# EAGLE design rubidium-osc-sa22c-breakout (EAGLE 9.2.2)
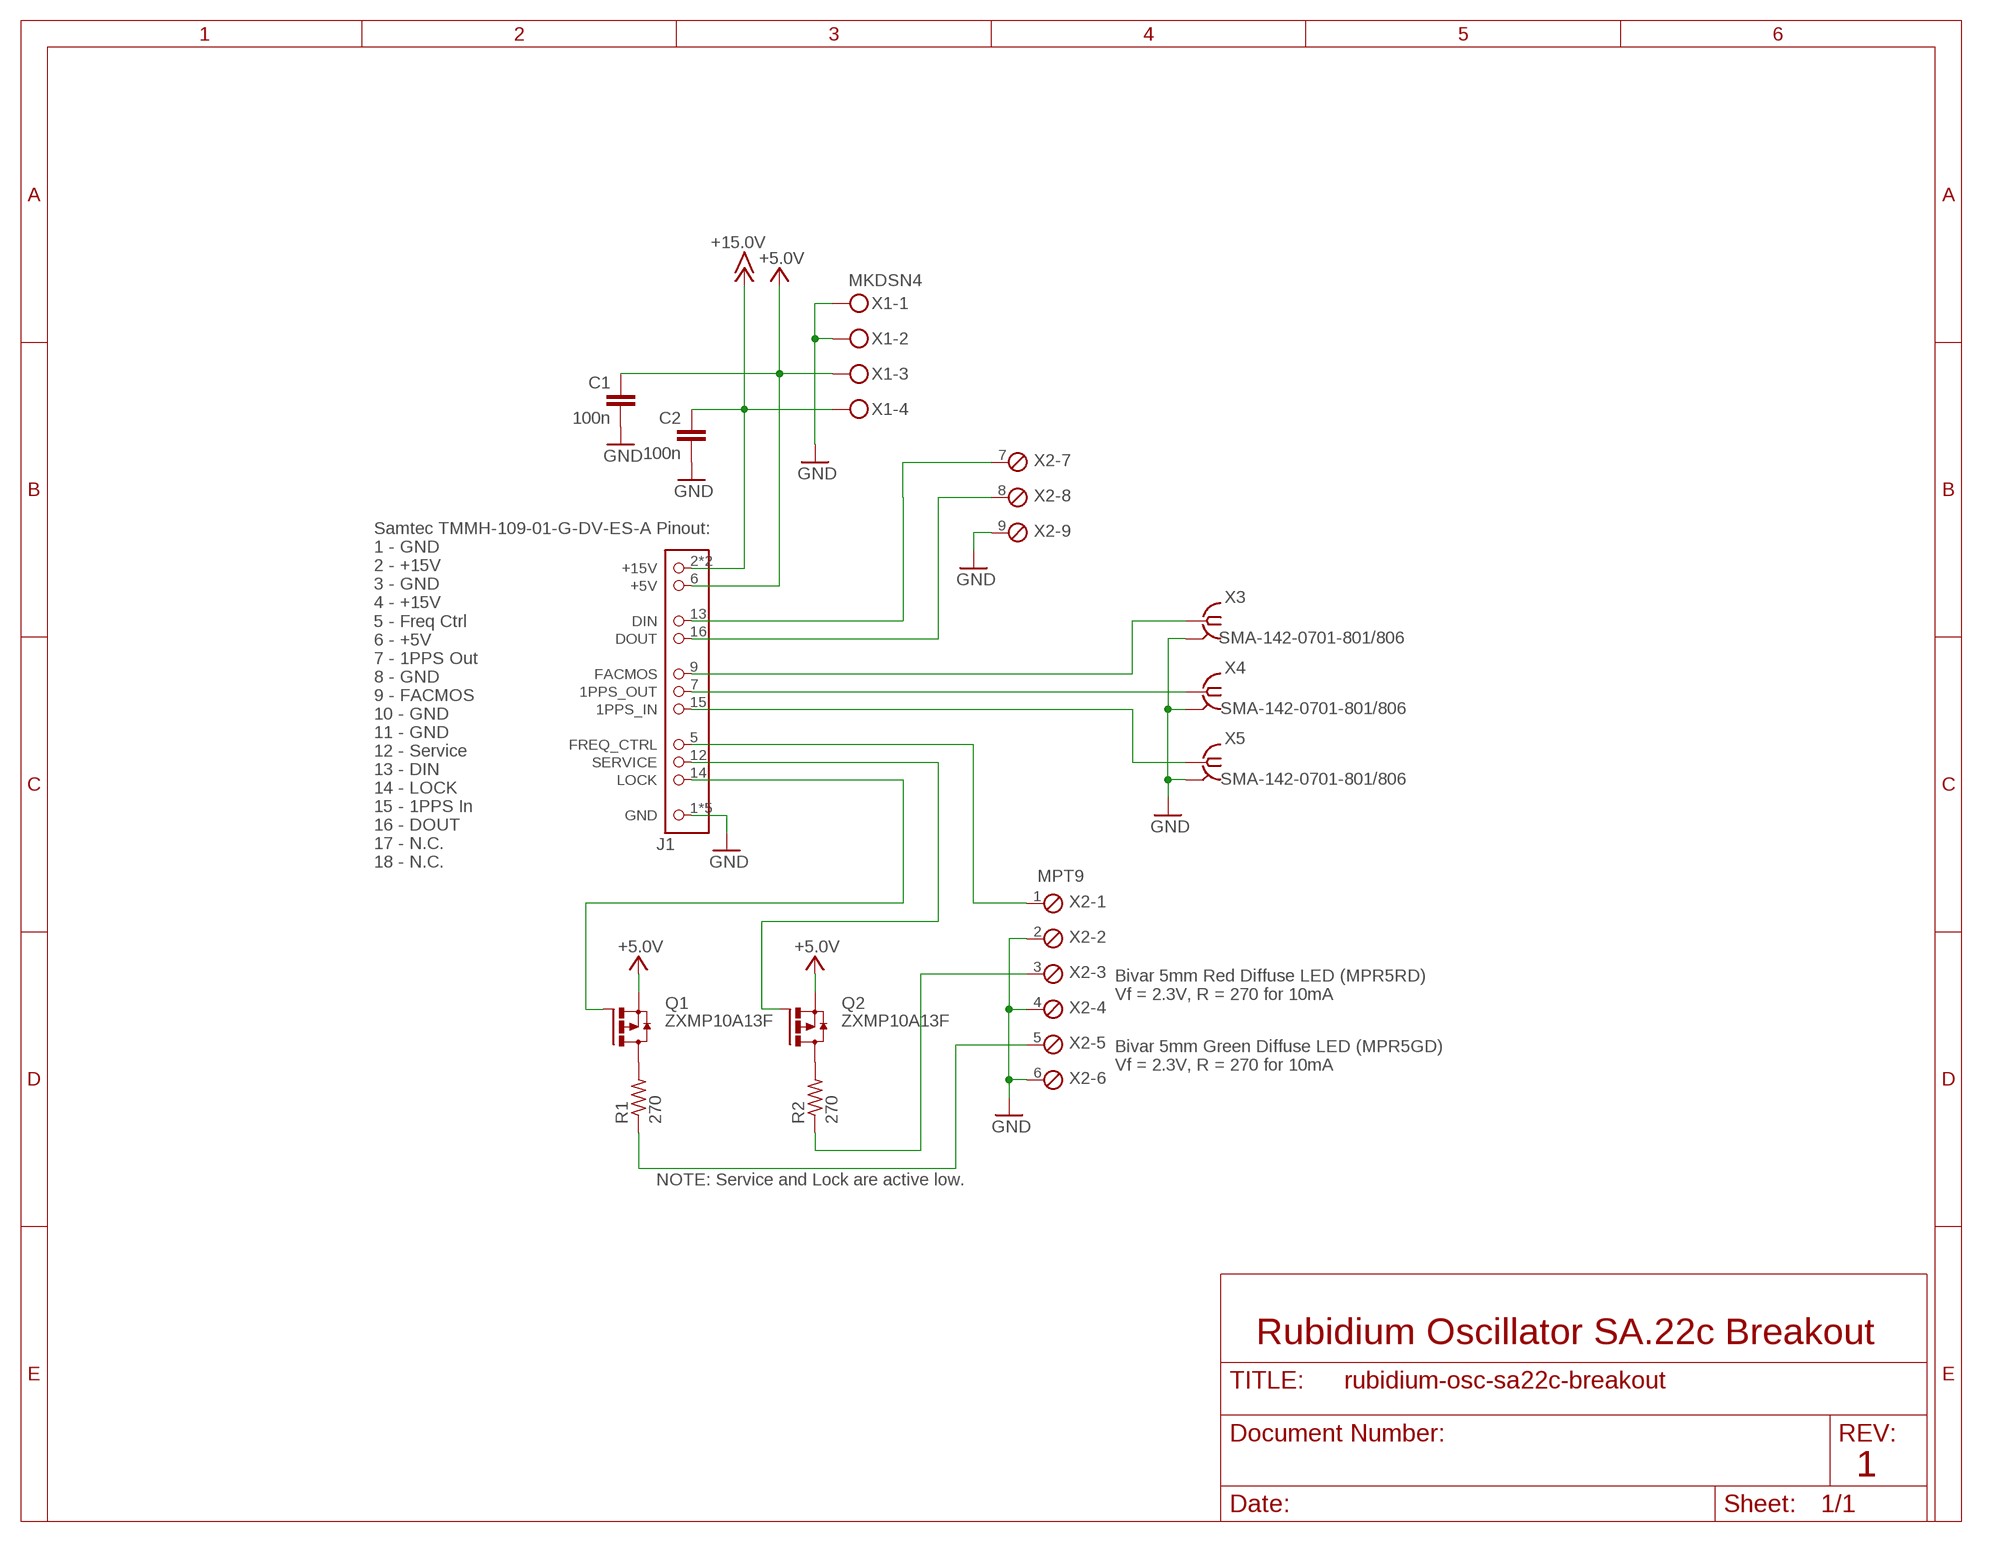
[diagram p0: schematic, sheet 1]

## Parts
C1  100n  C-EUC0603  [C0603]
C2  100n  C-EUC0603  [C0603]
J1  OSC_TMMH-109-01-G-DV-ES-A  [TMMH-109-XX-XX-DV-ES-A]
Q1  ZXMP10A13F  FDN360P  [SUPER-SOT3]
Q2  ZXMP10A13F  FDN360P  [SUPER-SOT3]
R1  270  R-US_R0603  [R0603]
R2  270  R-US_R0603  [R0603]
X1  MKDSN4  MKDSN1,5/4-5,08  [MKDSN1,5/4-5,08]
X2  MPT9  [9POL254]
X3  SMA-142-0701-801/806  [J502-ND-142-0701-801/806]
X4  SMA-142-0701-801/806  [J502-ND-142-0701-801/806]
X5  SMA-142-0701-801/806  [J502-ND-142-0701-801/806]

## Nets
+5V: C1.1 J1.6(+5V) Q1.2(S) Q2.2(S) X1.3 ; supply symbol labelled +5.0V
+15V: C2.1 J1.2(+15V) J1.4(+15V) X1.4 ; supply symbol labelled +15.0V
GND: C1.2 C2.2 J1.1(GND) J1.3(GND) J1.8(GND) J1.10(GND) J1.11(GND) X1.1 X1.2 X2.2 X2.4 X2.6 X2.9 X3.G@1 X3.G@2 X3.G@3 X3.G@4 X4.G@1 X4.G@2 X4.G@3 X4.G@4 X5.G@1 X5.G@2 X5.G@3 X5.G@4
N$1 [RF1]: J1.9(FACMOS) X3.1
N$2: J1.7(1PPS_OUT) X4.1
N$3: J1.15(1PPS_IN) X5.1
N$4: J1.13(DIN) X2.7
N$5: J1.16(DOUT) X2.8
N$6: Q1.3(D) R1.2
N$7: J1.5(FREQ_CTRL) X2.1
N$8: J1.12(SERVICE) Q2.1(G)
N$9: J1.14(LOCK) Q1.1(G)
N$10: Q2.3(D) R2.2
N$12: R2.1 X2.3
N$13: R1.1 X2.5

## Notes on the sheet
- Bivar 5mm Red Diffuse LED (MPR5RD)
  Vf = 2.3V, R = 270 for 10mA
- Bivar 5mm Green Diffuse LED (MPR5GD)
  Vf = 2.3V, R = 270 for 10mA
- NOTE: Service and Lock are active low.
- Rubidium Oscillator SA.22c Breakout
- 1

## Library data of the parts
C1 C2 = rcl:C-EU: CAPACITOR, European symbol; SPICEPREFIX: C
J1 = J-Samtec-TMMH-1XX-XX-XX-DV-XXX-XXX:OSC_TMMH-109-01-G-DV-ES-A: Samtec connector for SA.22c rubidium oscillator
Q1 Q2 = transistor-power:FDN360P: Single P-Channel, PowerTrench (R) MOSFET Source: http://www.fairchildsemi.com/ds/FD/FDN360P.pdf
R1 R2 = rcl:R-US_: RESISTOR, American symbol; SPICEPREFIX: R
X1 = con-phoenix-508:MKDSN1,5/4-5,08: MKDSN 1,5/ 4-5,08 Printklemme Nennstrom: 13,5 A Nennspannung: 250 V Rastermaß: 5,08 mm Polzahl: 4 Anschlussart: Schraubanschluss Montage: Löten Anschlussrichtung Leiter/Platine: 0 ° Artikelnummer: 1729144 Source: http://eshop.phoenixcontact.com .. 1729144.pdf
X2 = con-phoenix-254:MPT9: PHOENIX CONNECTOR; OC_FARNELL: unknown; OC_NEWARK: unknown
X3-X5 = con-coax:SMA-: SMA 50 Ohm End Launch Jack Receptacle - Round Contact Johnson Components Source: www.johnsoncomponents.com .. J502-ND.pdf; MF: JOHNSON COMPONENTS; MPN: 142-0701-801; OC_FARNELL: 1608592; OC_NEWARK: 90F2624

## Net classes
1 RF1: clearance 0.203 mm

## Board
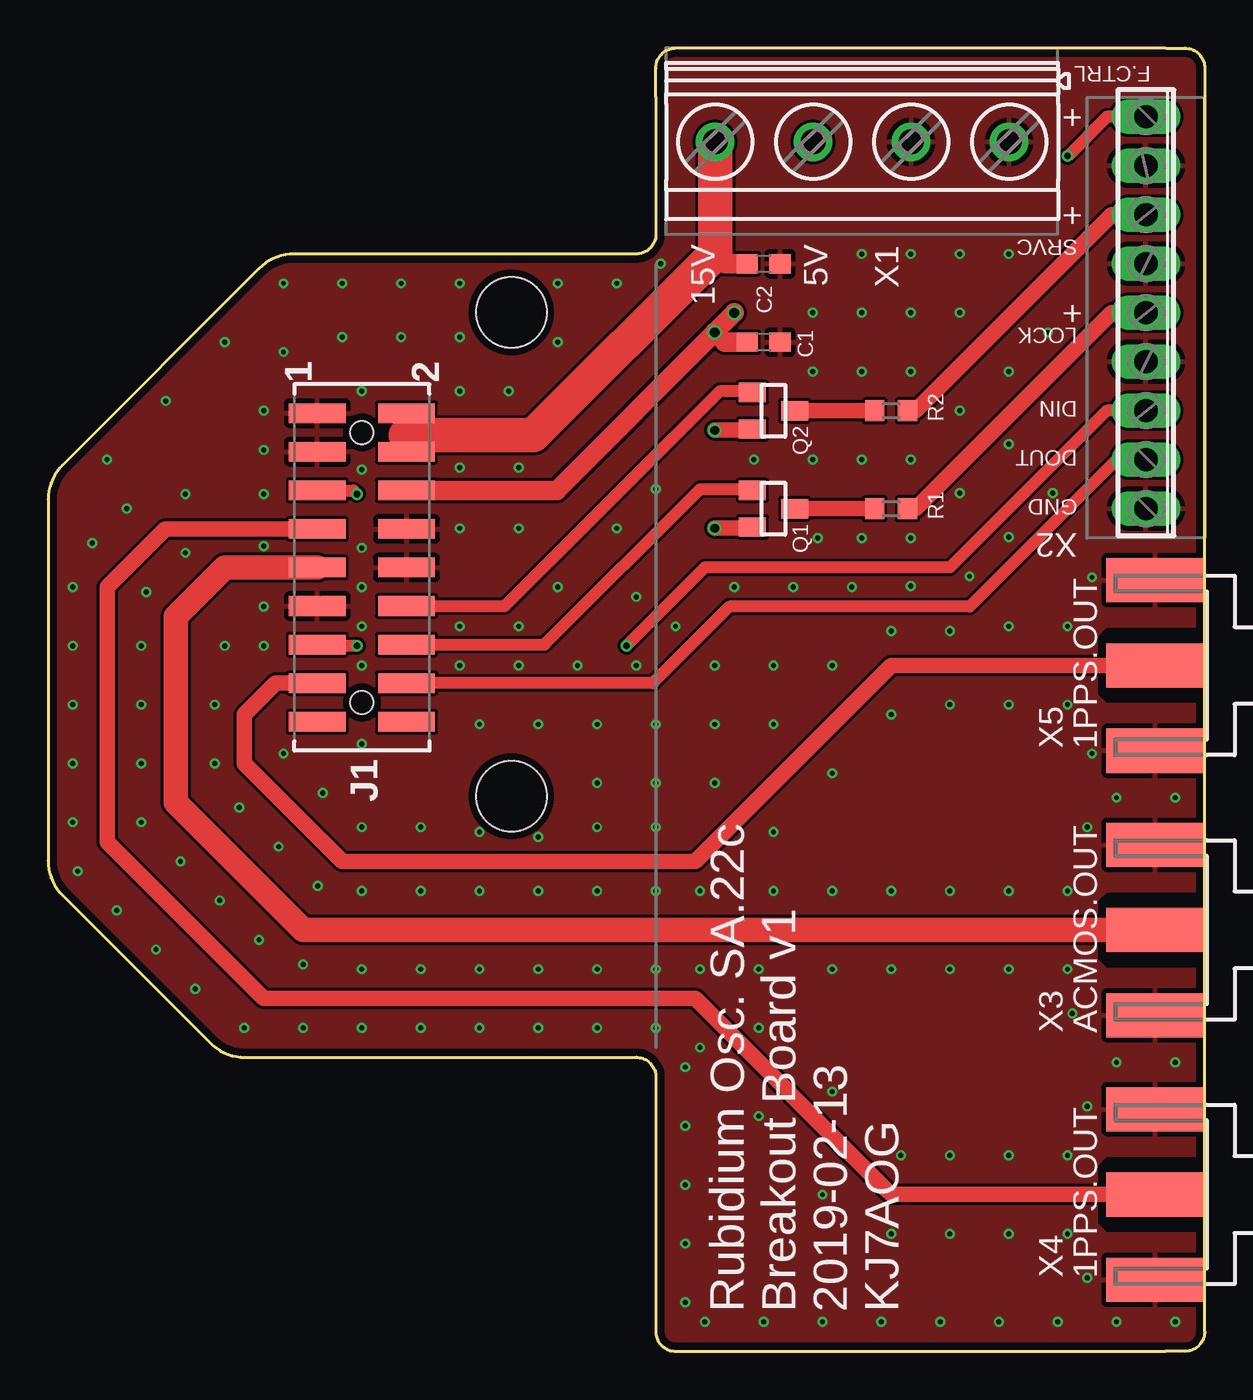
[diagram p1: board, top side]
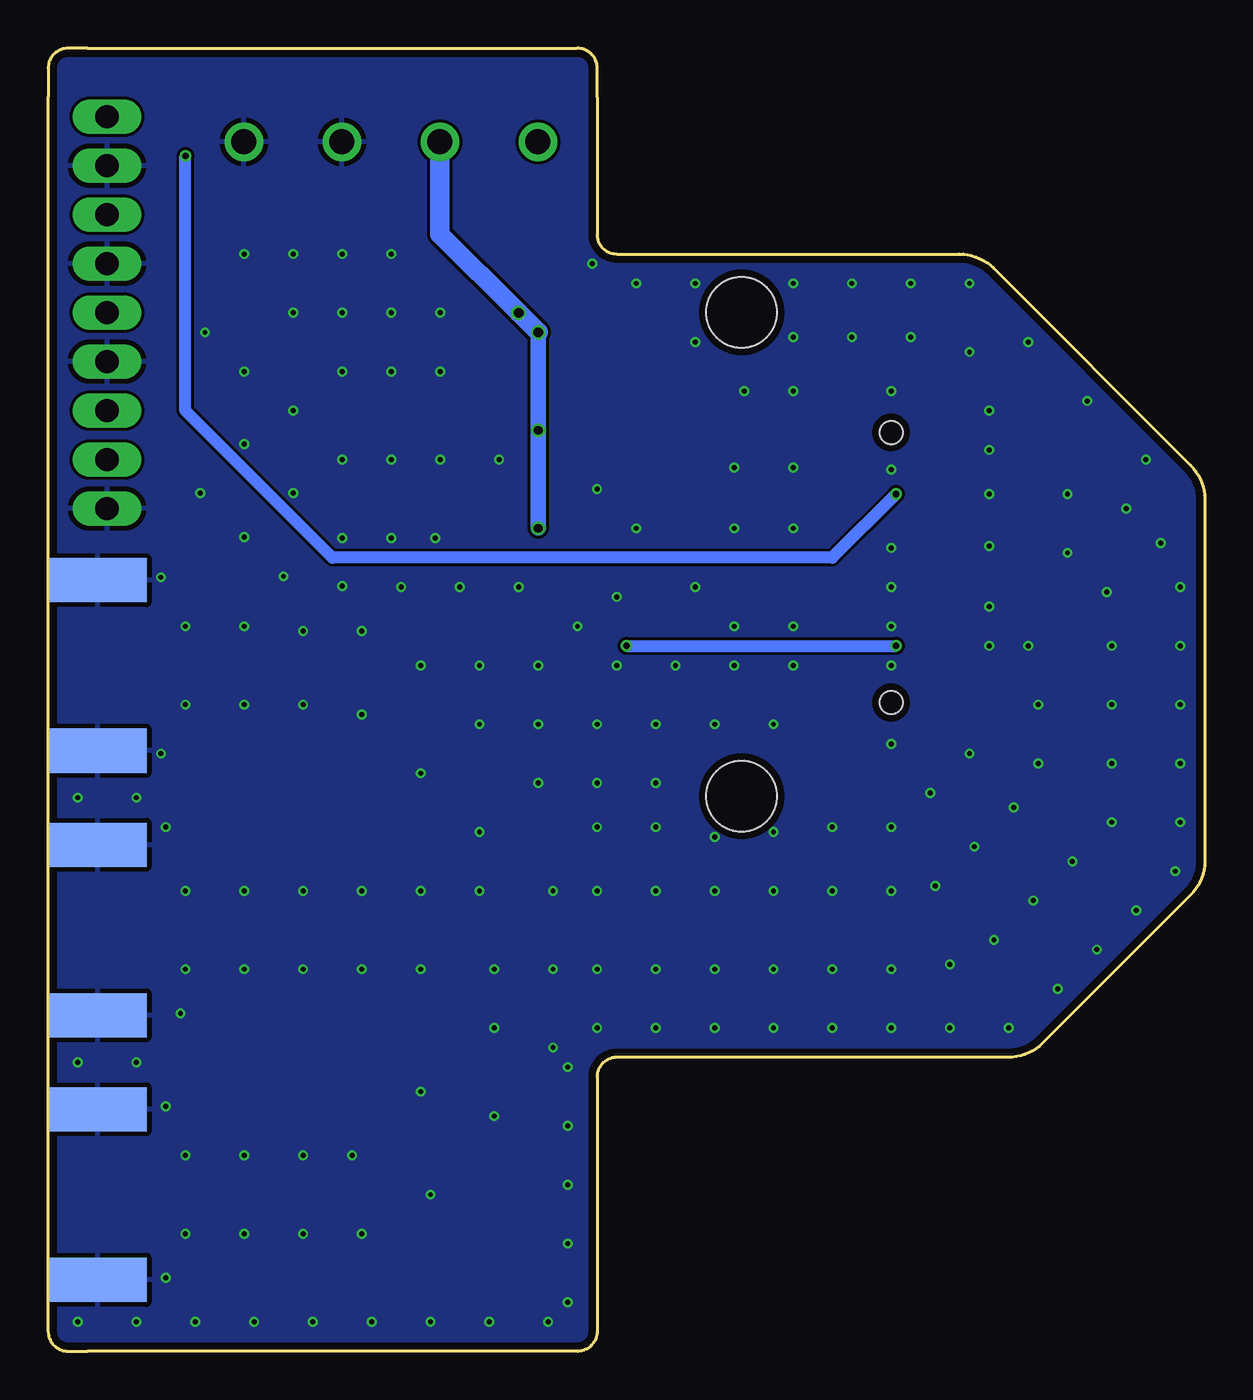
[diagram p2: board, bottom side, seen from below]

Size 59.94 x 67.56 mm. Coordinates in mm from the lower left corner, seen from the top.
Outline: 57.91,67.56 32.51,67.56 arc90 31.5,66.55 31.5,65.02 31.5,57.91 arc-90 30.48,56.9 12.74,56.9 arc45 10.94,56.15 0.74,45.96 arc45 0,44.16 0,25.44 arc45 0.74,23.64 8.4,15.98 arc45 10.2,15.24 30.48,15.24 arc-90 31.5,14.22 31.5,1.02 arc90 32.51,0 57.91,0 58.93,0 arc90 59.94,1.02 59.94,65.02 59.94,66.55 arc90 58.93,67.56 57.91,67.56
Copper layers (1*16): Top 0.035559375mm / dielectric 1.6mm / Bottom 0.035559375mm
Design rules "oshpark-2layer-tented": minimum track width 6mil, minimum drill 10mil, track to track 6mil, track to pad 6mil, pad to pad 6mil, via to via 6mil, smd to smd 6mil, copper to edge 15mil, drill to drill 6mil, minimum pad ring 5mil, minimum via ring 5mil, stop-mask expansion 2.5mil, vias tented up to drill 20mil, thermal gap 10mil
Holes 3.66 mm at 24,28.78 24,53.87

### Footprints (pad centres in the part's own frame; a part is rotated, then mirrored left to right if it is on the bottom)
C0603 = smd 1.1 x 1: 1 -0.85,0; 2 0.85,0
TMMH-109-XX-XX-DV-ES-A = smd 1.016 x 2.94: 1 -8,-2.315; 2 -8,2.315; 3 -6,-2.315; 4 -6,2.315; 5 -4,-2.315; 6 -4,2.315; 7 -2,-2.315; 8 -2,2.315; 9 0,-2.315; 10 0,2.315; 11 2,-2.315; 12 2,2.315; 13 4,-2.315; 14 4,2.315; 15 6,-2.315; 16 6,2.315; 17 8,-2.315; 18 8,2.315 | hole 1.19: -7,0; 7,0
SUPER-SOT3 = smd 1 x 1.4: 1 -0.95,-1.1; 2 0.95,-1.1; 3 0,1.1
R0603 = smd 1 x 1.1: 1 -0.85,0; 2 0.85,0
MKDSN1,5/4-5,08 = drill 1.3 pad 2: 1 -7.641,0.025; 2 -2.561,0.025; 3 2.519,0.025; 4 7.599,0.025
9POL254 = drill 1.2 long: 1 -10.16,0; 2 -7.62,0; 3 -5.08,0; 4 -2.54,0; 5 0,0; 6 2.54,0; 7 5.08,0; 8 7.62,0; 9 10.16,0
J502-ND-142-0701-801/806 = smd 5.08 x 2.286: 1 2.565,0; G@1 2.565,4.42; G@2 2.565,-4.42 | smd 5.08 x 2.286 bottom: G@3 2.565,4.42; G@4 2.565,-4.42

### Placement (x,y rotation side)
C1  37.08,52.32 0 top
C2  37.08,56.39 0 top
J1  16.26,40.64 270 top
Q1  37.59,43.69 270 top
Q2  37.59,48.77 270 top
R1  43.69,43.69 180 top
R2  43.69,48.77 180 top
X1  42.16,62.74 180 top
X2  56.9,53.85 270 top
X3  59.94,21.84 180 top
X4  59.94,8.13 180 top
X5  59.94,35.56 180 top

### Tracks (layer width: path | path; a pad name or v marks a point on that pad's centre or on a via)
+5V  (via drill 0.45, 0.5)
  Top 0.61: 36.43,47.75 Q2.2 | 36.43,42.67 Q1.2
  Top 0.813: v34.54,47.75 36.43,47.75 | v34.54,42.67 36.43,42.67
  Top 1.016: v35.56,53.85 v34.54,52.83 | v34.54,52.83 26.35,44.64 J1.6 | v34.54,52.83 35.05,52.32 C1.1
  Bottom 0.813: v34.54,52.83 v34.54,47.75 v34.54,42.67
  Bottom 1.016: X1.3 39.65,57.93 v35.56,53.85 v34.54,52.83
+15V
  Top 1.016: J1.2 18.54,48.61 18.54,47.5 18.54,46.67 J1.4 | C2.1 35.09,56.39 34.56,56.92
  Top 1.778: X1.4 34.56,56.92 25.15,47.5 18.54,47.5
GND  (via drill 0.25)
  other vias: 2.29,41.91 1.52,24.89 1.27,27.43 1.27,30.48 1.27,33.53 1.27,39.62 10.16,16.76 5.59,20.83 3.56,22.86 7.62,18.8 4.83,27.43 13.21,20.07 6.86,25.4 8.89,23.37 10.92,21.34 4.83,30.48 4.83,33.53 4.83,36.58 5.08,39.37 7.11,41.4 11.18,41.76 16.26,41.66 16.26,39.62 16.26,45.72 16.26,37.59 16.26,35.56 11.18,38.61 9.14,36.58 8.64,33.53 8.64,30.48 9.91,28.19 11.94,26.16 13.97,24.13 16.26,23.88 16.26,19.81 13.21,16.76 16.26,16.76 1.27,36.58 11.18,44.45 7.11,44.45 4.06,43.69 11.18,36.58 16.26,31.5 16.26,49.78 12.19,30.99 16.26,27.18 19.3,23.88 19.3,19.81 19.3,16.76 22.35,23.88 22.35,19.81 22.35,16.76 25.4,16.76 25.4,19.81 25.4,23.88 28.45,23.88 28.45,19.81 28.45,16.76 31.5,16.76 31.5,19.81 31.5,23.88 28.45,27.18 19.3,27.18 22.35,26.92 25.4,26.67 31.5,27.18 14.22,28.96 12.19,55.37 9.14,52.32 6.1,49.28 3.05,46.23 15.24,55.37 18.29,55.37 21.34,55.37 31.75,56.39 26.42,55.37 29.46,55.37 26.42,52.32 23.88,49.78 21.34,49.78 21.34,52.58 18.29,52.58 15.24,52.58 12.19,51.82 11.18,48.77 11.18,46.74 21.34,42.67 41.66,39.62 24.38,42.67 21.34,45.82 24.38,45.82 49.78,56.9 44.7,56.9 42.16,56.9 47.24,56.9 44.7,50.8 44.7,53.85 47.24,53.85 42.16,53.85 42.16,50.8 42.16,46.23 44.7,46.23 39.62,46.23 39.62,50.8 39.62,53.85 47.24,48.77 49.78,50.8 39.88,42.16 42.16,42.16 44.7,42.16 47.24,44.5 49.78,47.04 51.82,52.83 49.78,42.21 52.07,44.5 47.75,40.18 44.7,39.67 38.61,39.62 35.56,39.62 21.34,35.56 21.34,37.59 24.38,37.59 26.42,39.62 29.46,42.67 31.5,44.7 36.58,46.23 30.48,35.56 24.38,35.56 27.43,35.56 32.51,37.59 33.78,23.88 37.59,23.88 40.64,23.88 43.69,23.88 46.74,23.88 33.78,19.81 36.83,19.81 40.64,19.81 43.69,19.81 46.74,19.81 49.78,19.81 49.78,23.88 53.09,17.53 53.85,27.18 52.83,23.88 52.83,19.81 53.85,12.7 53.85,3.81 52.83,10.16 52.83,6.1 49.78,10.16 49.78,6.1 54.1,30.99 52.83,33.53 52.83,37.59 54.1,40.13 49.78,37.59 49.78,33.53 46.74,33.53 46.74,37.34 43.69,33.02 40.64,29.97 37.59,26.92 43.69,37.34 40.64,35.56 37.59,32.51 34.54,29.46 30.48,39.12 37.59,35.56 34.54,35.56 34.54,32.51 31.5,32.51 31.5,29.46 28.45,32.51 28.45,29.46 22.35,32.51 25.4,32.51 46.74,10.16 46.74,6.1 43.69,6.1 44.2,10.16 40.64,13.46 36.83,16.76 40.13,8.13 36.83,12.19 33.78,15.75 33.02,14.73 33.02,11.68 33.02,8.64 33.02,5.59 33.02,2.54 52.32,1.52 58.42,1.52 55.37,1.52 49.28,1.52 46.23,1.52 43.18,1.52 40.13,1.52 37.08,1.52 58.42,14.99 55.37,14.99 58.42,28.7 55.37,28.7 34.04,1.52
  pour Bottom: 0,0 59.94,0 59.94,67.56 0,67.56
  pour Top: 0,0 59.94,0 59.94,6.1 54.86,6.1 54.36,6.6 54.36,9.65 54.86,10.16 59.94,10.16 59.94,19.81 54.86,19.81 54.36,20.32 54.36,23.37 54.86,23.88 59.94,23.88 59.94,33.53 54.86,33.53 54.36,34.04 54.36,37.08 54.86,37.59 59.94,37.59 59.94,67.56 0,67.56
N$1
  Top 1.27: J1.9 9.14,40.64 6.6,38.1 6.6,28.45 13.21,21.84 X3.1
N$2
  Top 0.813: J1.7 6.06,42.64 3.05,39.62 3.05,26.42 11.18,18.29 33.53,18.29 43.43,8.38 43.69,8.13 X4.1
N$3
  Top 0.813: J1.15 11.78,34.64 10.16,33.02 10.16,32 10.16,30.48 15.24,25.4 33.53,25.4 43.69,35.56 X5.1
N$4  (via drill 0.35)
  Top 0.61: v29.97,36.58 34.04,40.64 46.74,40.64 54.86,48.77 X2.7 | v16,36.58 14.01,36.58 J1.13
  Bottom 0.61: v29.97,36.58 v16,36.58
N$5
  Top 0.61: J1.16 31.34,34.64 35.31,38.61 47.75,38.61 55.37,46.23 X2.8
N$6
  Top 0.813: R1.2 Q1.3
N$7  (via drill 0.35)
  Top 0.61: X2.1 54.86,64.01 v52.83,61.98 | J1.5 15.81,44.64 v16,44.45
  Bottom 0.61: v52.83,61.98 52.83,48.77 45.21,41.15 19.3,41.15 v16,44.45
N$8
  Top 0.61: J1.12 23.65,38.64 34.8,49.78 36.43,49.78 Q2.1
N$9
  Top 0.61: J1.14 25.72,36.64 33.78,44.7 36.43,44.7 Q1.1
N$10
  Top 0.813: R2.2 Q2.3
N$12
  Top 0.813: X2.3 55.12,58.93 44.96,48.77 R2.1
N$13
  Top 0.813: R1.1 44.96,43.69 55.12,53.85 X2.5

### Text on the board
tPlace: F.CTRL | + | + | SRVC | 15V | 5V | + | LOCK | DIN | DOUT | GND | 1PPS.OUT | ACMOS.OUT | 1PPS.OUT | Rubidium Osc. SA.22c / Breakout Board v1 / 2019-02-13 / KJ7AOG